# EAGLE design IR Sensor (EAGLE 9.6.2)
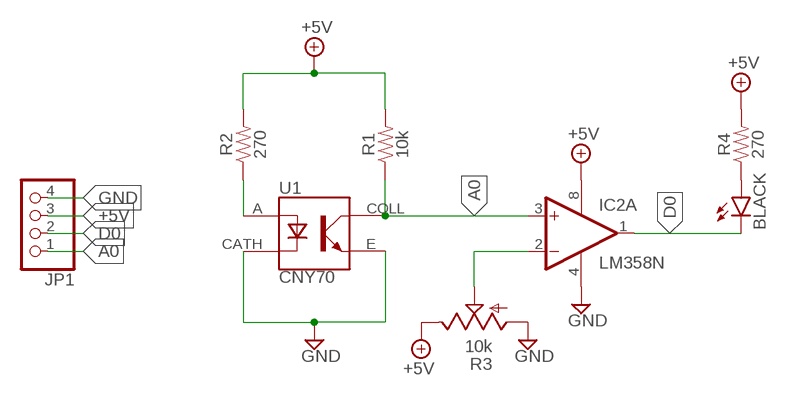
[diagram p0: schematic, sheet 1]

## Parts
BLACK  LED3MM  [LED3MM]
IC2  LM358N  [DIL08]
JP1  PINHD-1X4/90  [1X04/90]
R1  10k  RESISTORAXIAL-0.3  [AXIAL-0.3]
R2  270  RESISTORAXIAL-0.3  [AXIAL-0.3]
R3  10k  TRIM_US-CA6V  [CA6V]
R4  270  RESISTORAXIAL-0.3  [AXIAL-0.3]
U1  CNY70  [DIPS254W50P254L710H600Q4]

## Nets
+5V: IC2.8(P:V+) JP1.3 R1.P$2 R2.P$2 R3.E R4.P$2
A0: IC2.3(A:+IN) JP1.1 R1.P$1 U1.COLL
D0: BLACK.K(C) IC2.1(A:OUT) JP1.2
GND: IC2.4(P:V-) JP1.4 R3.A U1.CATH U1.E
N$1: R2.P$1 U1.A
N$3: IC2.2(A:-IN) R3.S
N$5: BLACK.A R4.P$1
Unconnected: IC2.5(B:+IN) IC2.6(B:-IN) IC2.7(B:OUT)

## Library data of the parts
BLACK = led:LED: LED OSRAM: - CHIPLED LG R971, LG N971, LY N971, LG Q971, LY Q971, LO R971, LY R971 LH N974, LH R974 LS Q976, LO Q976, LY Q976 LO Q996 - Hyper CHIPLED LW Q18S LB Q993, LB Q99A, LB R99A - SideLED LS A670, LO A670, LY A670, LG A670, LP A670 LB A673, LV A673, LT A673, LW A673 LH A674 LY A675 LS A676, LA A676, LO A676, LY A676, LW A676 LS A679, LY A679, LG A679 - Hyper Micro SIDELED® LS Y876, LA Y876, LO Y876, LY Y876 LT Y87S - SmartLED LW L88C, LW L88S LB L89C, LB L89S, LG L890 LS L89K, LO L89K, LY L89K LS L896, LA L896, LO L896, LY L896 - TOPLED LS T670, LO T670, LY T670, LG T670, LP T670 LSG T670, LSP T670, LSY T670, LOP T670, LYG T670 LG T671, LOG T671, LSG T671 LB T673, LV T673, LT T673, LW T673 LH T674 LS T676, LA T676, LO T676, LY T676, LB T676, LH T676, LSB T676, LW T676 LB T67C, LV T67C, LT T67C, LS T67K, LO T67K, LY T67K, LW E67C LS E67B, LA E67B, LO E67B, LY E67B, LB E67C, LV E67C, LT E67C LW T67C LS T679, LY T679, LG T679 LS T770, LO T770, LY T770, LG T770, LP T770 LB T773, LV T773, LT T773, LW T773 LH T774 LS E675, LA E675, LY E675, LS T675 LS T776, LA T776, LO T776, LY T776, LB T776 LHGB T686 LT T68C, LB T68C - Hyper Mini TOPLED® LB M676 - Mini TOPLED Santana® LG M470 LS M47K, LO M47K, LY M47K Source: http://www.osram.convergy.de LUXEON: - LUMILED® LXK2-PW12-R00, LXK2-PW12-S00, LXK2-PW14-U00, LXK2-PW14-V00 LXK2-PM12-R00, LXK2-PM12-S00, LXK2-PM14-U00 LXK2-PE12-Q00, LXK2-PE12-R00, LXK2-PE12-S00, LXK2-PE14-T00, LXK2-PE14-U00 LXK2-PB12-K00, LXK2-PB12-L00, LXK2-PB12-M00, LXK2-PB14-N00, LXK2-PB14-P00, LXK2-PB14-Q00 LXK2-PR12-L00, LXK2-PR12-M00, LXK2-PR14-Q00, LXK2-PR14-R00 LXK2-PD12-Q00, LXK2-PD12-R00, LXK2-PD12-S00 LXK2-PH12-R00, LXK2-PH12-S00 LXK2-PL12-P00, LXK2-PL12-Q00, LXK2-PL12-R00 Source: www.luxeon.com KINGBRIGHT: KA-3528ASYC Source: www.kingbright.com
IC2 = linear:LM358: OP AMP also LM158; LM258; LM2904 Source: http://cache.national.com/ds/LM/LM158.pdf
JP1 = pinhead:PINHD-1X4: PIN HEADER
R1 R2 R4 = SparkFun-Resistors:RESISTOR: Generic Resistor Package
R3 = pot:TRIM_US-: POTENTIOMETER
U1 = CNY70:CNY70: CNY70 Series 1 mA 1.25 V 950 nm 200 mW Reflective Optical Sensor 4 Pin Check prices <https://pricing.snapeda.com/parts/CNY70/Vishay/view-part?ref=eda>; AVAILABILITY: Good; DESCRIPTION: Reflective Optical Sensor 0.197 (5mm) PCB Mount; MF: Vishay; MP: CNY70; PACKAGE: PCB Mount Vishay; PRICE: None; PURCHASE-URL: https://pricing.snapeda.com/search/part/CNY70/?ref=eda

## Board
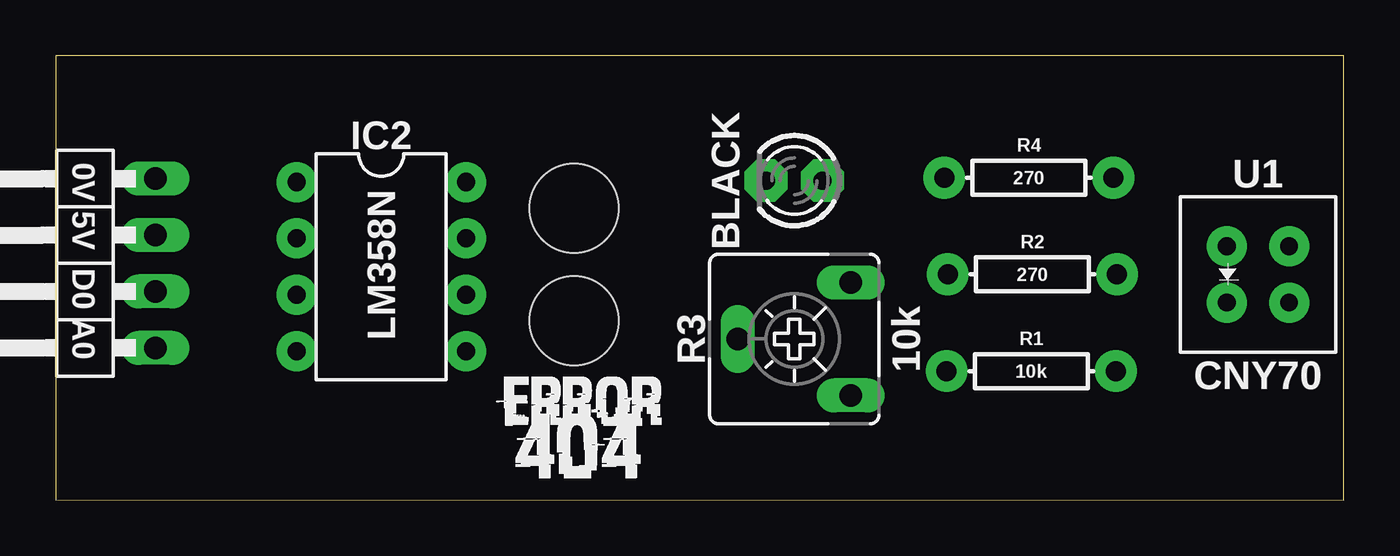
[diagram p1: board, top side]
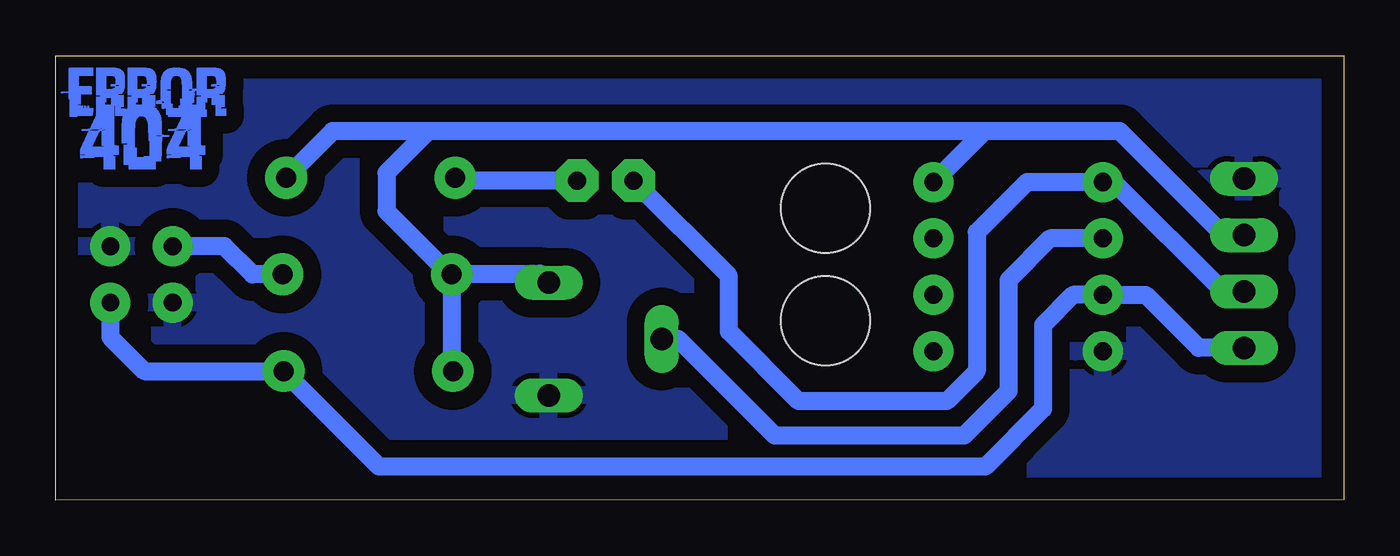
[diagram p2: board, bottom side, seen from below]

Size 58 x 20 mm. Coordinates in mm from the lower left corner, seen from the top.
Outline: 0,0.01 58,0 58,20 0,20 0,0.01
Copper layers (1*16): Top 0.035mm / dielectric 1.5mm / Bottom 0.035mm
Design rules "default *": minimum track width 0.8mm, minimum drill 0.7mm, track to track 0.6mm, track to pad 0.6mm, pad to pad 0.6mm, via to via 0.6mm, smd to smd 0.6mm, copper to edge 40mil, drill to drill 6mil, minimum pad ring 10mil, minimum via ring 8mil, stop-mask expansion 4mil, vias tented up to drill 0mil, thermal gap 10mil
Holes 4 mm at 23.34,13.12 23.34,8.07

### Footprints (pad centres in the part's own frame; a part is rotated, then mirrored left to right if it is on the bottom)
LED3MM = drill 0.813 pad 1.93 octagon: A -1.27,0; K 1.27,0
DIL08 = drill 0.813 pad 1.8: 1 -3.81,-3.81; 2 -1.27,-3.81; 3 1.27,-3.81; 4 3.81,-3.81; 5 3.81,3.81; 6 1.27,3.81; 7 -1.27,3.81; 8 -3.81,3.81
1X04/90 = drill 1.016 long: 1 -3.81,-3.81; 2 -1.27,-3.81; 3 1.27,-3.81; 4 3.81,-3.81
AXIAL-0.3 = drill 0.9 pad 1.88: P$1 -3.81,0; P$2 3.81,0
CA6V = drill 1.016 long: A -2.54,-2.54; E 2.54,-2.54; S 0,2.54
DIPS254W50P254L710H600Q4 = drill 0.8 pad 1.8: A -1.4,1.27; CATH -1.4,-1.27; COLL 1.4,-1.27; E 1.4,1.27

### Placement (x,y rotation side)
BLACK  33.26,14.38 180 top
IC2  14.66,10.5 270 top
JP1  0.69,10.65 90 top
R1  43.92,5.8 180 top
R2  43.98,10.15 180 top
R3  33.26,7.25 90 top
R4  43.81,14.5 0 top
U1  54.13,10.15 0 top
U$1  [ERROR404_X0.5_T]  53.6,17.38 0 bottom
U$2  [ERROR404_X0.5_TN]  24,3.48 0 top

### Tracks (layer width: path | path; a pad name or v marks a point on that pad's centre or on a via)
+5V
  Bottom 0.8: 5.28,11.92 JP1.3 5.42,11.92 10.09,16.6 15.57,16.6 16.18,16.6 | 16.18,16.6 16.2,16.6 | R4.P$2 45.53,16.6 41.23,16.6 | 41.23,16.6 18.35,16.6 16.23,16.6 16.18,16.6 | R2.P$2 40.25,10.15 43.1,13 43.1,14.72 41.23,16.6 | R2.P$2 40.16,5.85 R1.P$2 | R2.P$2 40.13,10.19 36.2,10.19 R3.E | IC2.8 16.18,16.6
A0
  Bottom 0.8: U1.COLL 55.53,7.33 54.01,5.8 R1.P$1 43.43,1.5 16.15,1.5 13.55,4.1 13.55,7.88 12.2,9.23 IC2.3 8.93,9.23 6.54,6.84 JP1.1
D0
  Bottom 0.8: JP1.2 5.43,9.38 10.36,14.31 IC2.1 14.27,14.31 16.52,12.05 16.52,5.8 17.88,4.45 24.55,4.45 27.69,7.59 27.69,10.09 31.98,14.38 BLACK.K
GND
  pour Bottom (isolate 0.8): -9.5,30 66.25,30 66.25,-3.25 -9.5,-3.25
N$1
  Bottom 0.8: R2.P$1 49.13,10.15 50.41,11.42 U1.A
N$3
  Bottom 0.8: IC2.2 13.23,11.77 15.1,9.9 15.1,4.9 17.1,2.9 25.62,2.9 29.97,7.25 R3.S
N$5
  Bottom 0.8: R4.P$1 | BLACK.A 34.72,14.38 39.88,14.38 R4.P$1

### Text on the board
tNames: 0V 5V D0 A0